# Altium schematic sheet TopLevel.SchDoc
size A4; SheetNumber: 1; SheetTotal: 2
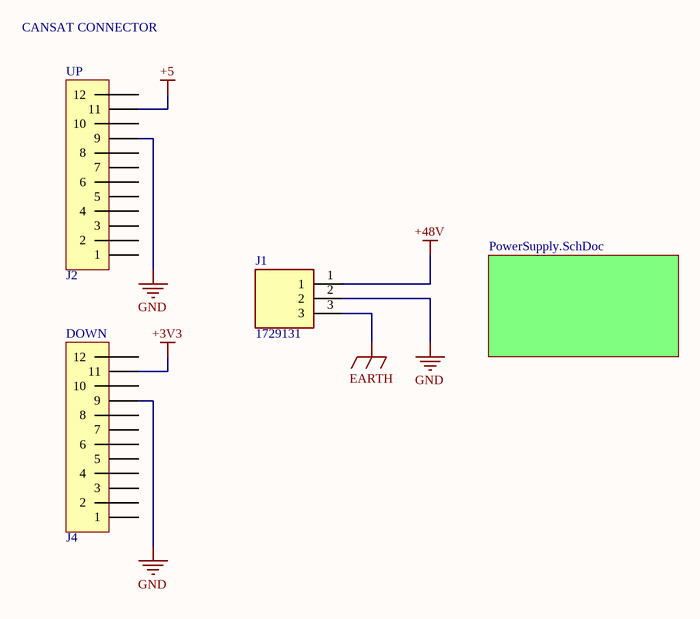
[diagram p0: TopLevel.SchDoc]

## Parts
J1  1729131  [1729131]
J2  *  [PINHEADER2X6 P2.54 SIDE MOUNT]  (value not drawn)
J4  *  [PINHEADER2X6 P2.54 SIDE MOUNT]  (value not drawn)

## Sub-sheets
Designator = PowerSupply.SchDoc: no entries

## Nets
+3V3: J4.11
+5: J2.11
+48V: J1.1
EARTH: J1.3
GND: J1.2 J2.9 J4.9

Not connected (* = marked no-connect by the designer): J2 1 2 3 4 5 6 7 8 10 12; J4 1 2 3 4 5 6 7 8 10 12

## Notes on the sheet
- CANSAT CONNECTOR
- (near J2) UP
- (near J4) DOWN

## Library data of the parts
J1 = 1729131: Connector; Manufacturer_Name: Phoenix Contact; Datasheet Link: http://www.phoenixcontact.com/de/produkte/1729131/pdf; Height: 10.15mm; Manufacturer_Part_Number: 1729131; Mouser Part Number: 651-1729131; Mouser Price/Stock: https://www.mouser.co.uk/ProductDetail/Phoenix-Contact/1729131?qs=GFUSqQMLmmkspw%2F%2FW6PC3g%3D%3D; Arrow Part Number: 1729131; Arrow Price/Stock: https://www.arrow.com/en/products/1729131/phoenix-contact
J2 J4 = PinHeader2x6: Plug connector; Value: *